# EAGLE design RPIcoffeeOptocouplerboard (EAGLE 9.4.2)
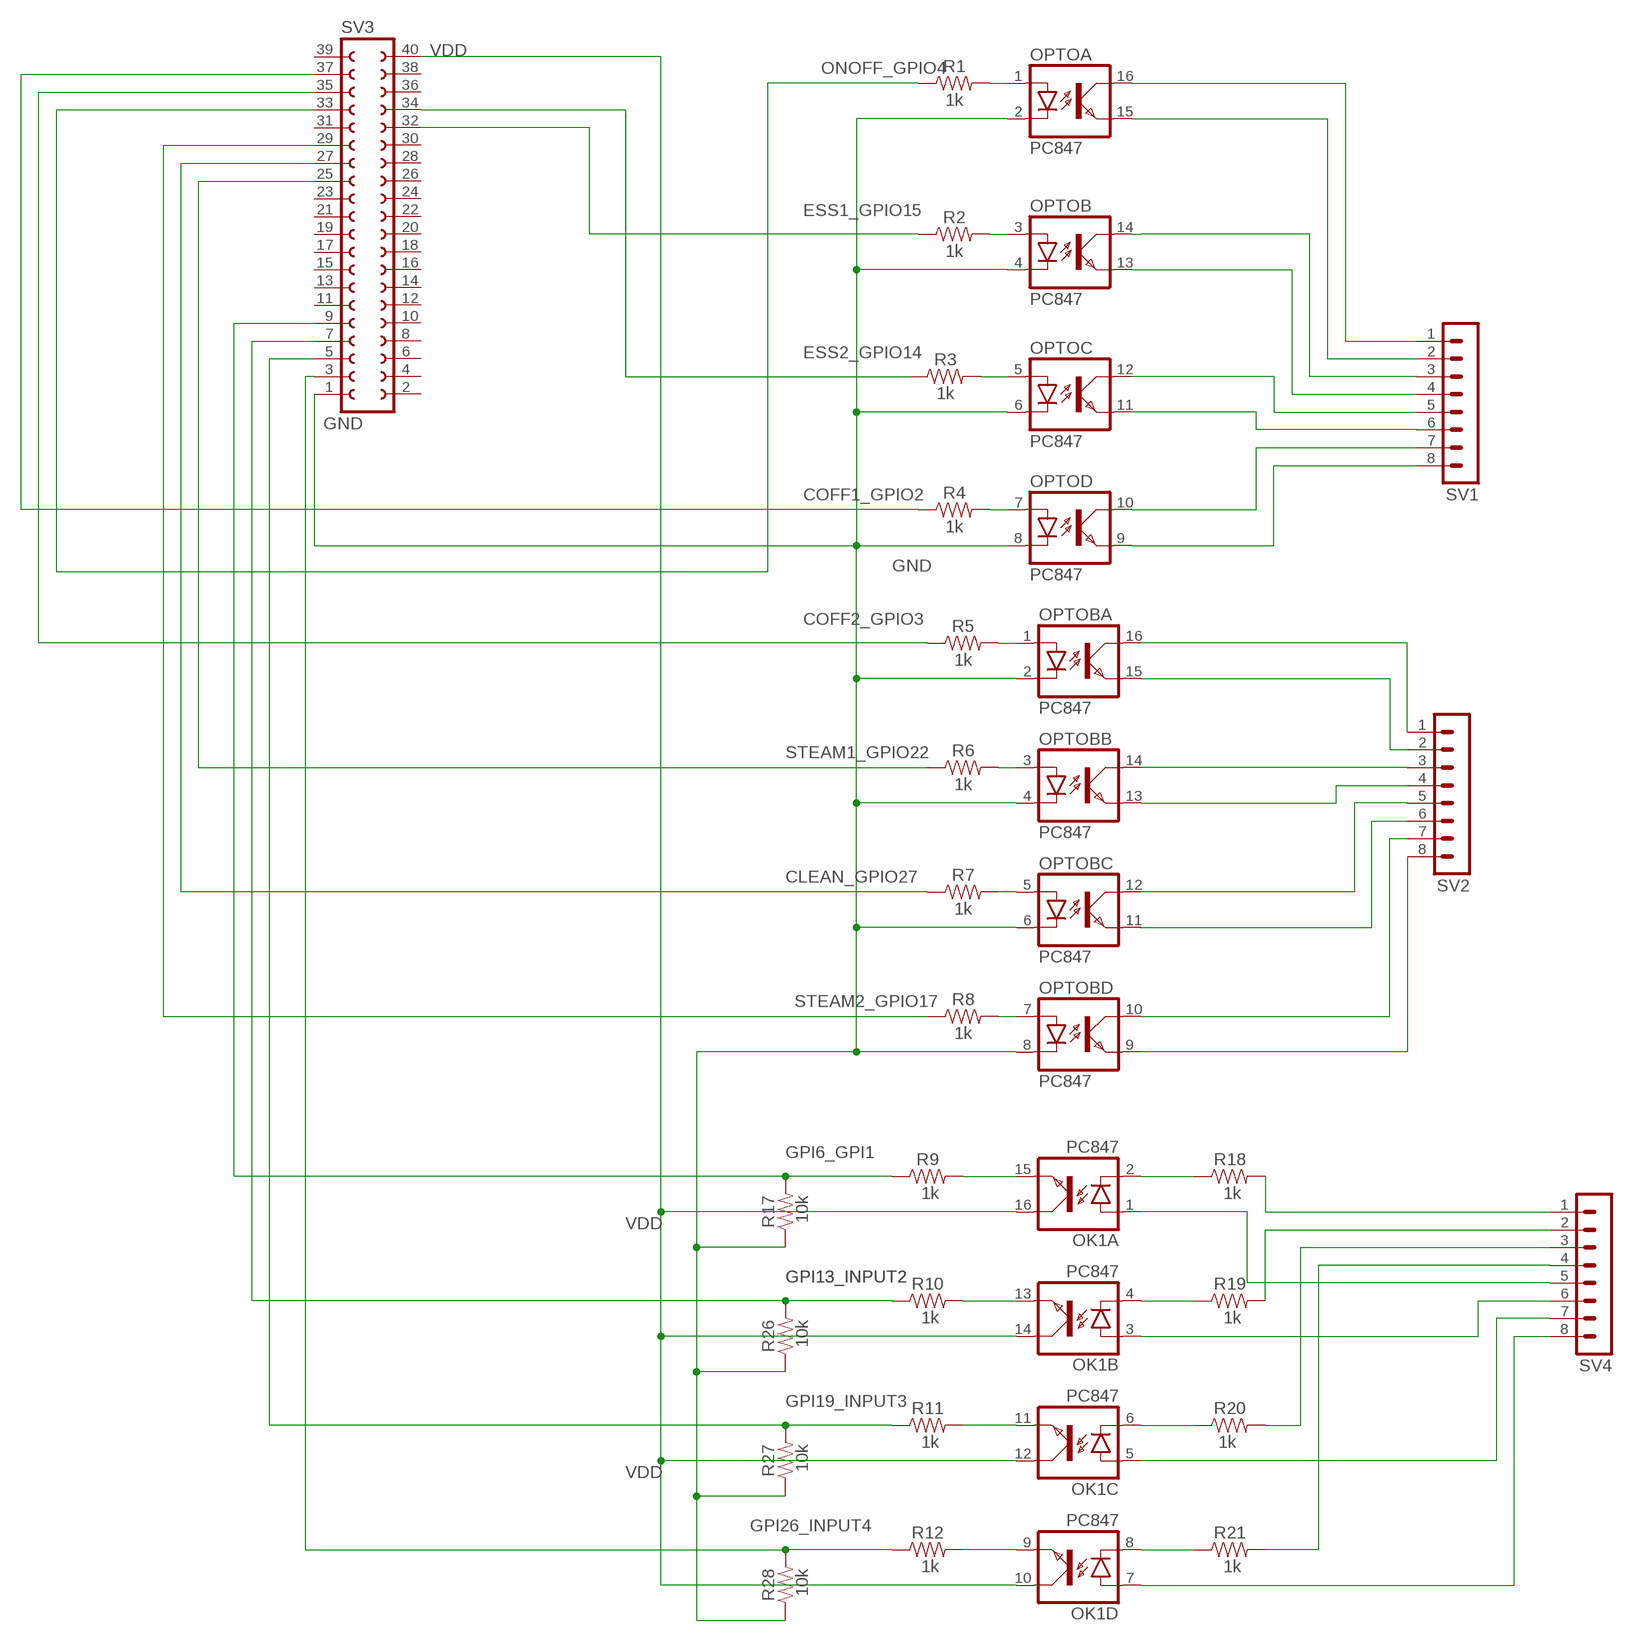
[diagram p0: schematic, sheet 1]

## Parts
OK1  PC847  [DIL16]
OPTO  PC847  [DIL16]
OPTOB  PC847  [DIL16]
R1  1k  1KOHM-HORIZ-1/4W-5%  [AXIAL-0.3]
R2  1k  1KOHM-HORIZ-1/4W-5%  [AXIAL-0.3]
R3  1k  1KOHM-HORIZ-1/4W-5%  [AXIAL-0.3]
R4  1k  1KOHM-HORIZ-1/4W-5%  [AXIAL-0.3]
R5  1k  1KOHM-HORIZ-1/4W-5%  [AXIAL-0.3]
R6  1k  1KOHM-HORIZ-1/4W-5%  [AXIAL-0.3]
R7  1k  1KOHM-HORIZ-1/4W-5%  [AXIAL-0.3]
R8  1k  1KOHM-HORIZ-1/4W-5%  [AXIAL-0.3]
R9  1k  RESISTORAXIAL-0.3  [AXIAL-0.3]
R10  1k  RESISTORAXIAL-0.3  [AXIAL-0.3]
R11  1k  RESISTORAXIAL-0.3  [AXIAL-0.3]
R12  1k  RESISTORAXIAL-0.3  [AXIAL-0.3]
R17  10k  RESISTORAXIAL-0.3  [AXIAL-0.3]
R18  1k  RESISTORAXIAL-0.3  [AXIAL-0.3]
R19  1k  RESISTORAXIAL-0.3  [AXIAL-0.3]
R20  1k  RESISTORAXIAL-0.3  [AXIAL-0.3]
R21  1k  RESISTORAXIAL-0.3  [AXIAL-0.3]
R26  10k  RESISTORAXIAL-0.3  [AXIAL-0.3]
R27  10k  RESISTORAXIAL-0.3  [AXIAL-0.3]
R28  10k  RESISTORAXIAL-0.3  [AXIAL-0.3]
SV1  MA08-1  [MA08-1]
SV2  MA08-1  [MA08-1]
SV3  FE20-2  [FE20-2]
SV4  MA08-1  [MA08-1]

## Nets
CLEAN_GPIO27: R7.P$1 SV3.27
COFF1_GPIO2: R4.P$1 SV3.37
COFF2_GPIO3: R5.P$1 SV3.35
ESS1_GPIO15: R2.P$1 SV3.32
ESS2_GPIO14: R3.P$1 SV3.34
GND: OPTO.2(A:C) OPTO.4(B:C) OPTO.6(C:C) OPTO.8(D:C) OPTOB.2(A:C) OPTOB.4(B:C) OPTOB.6(C:C) OPTOB.8(D:C) R17.P$1 R26.P$1 R27.P$1 R28.P$1 SV3.1
GPI6_GPI1: R9.P$1 R17.P$2 SV3.9
GPI13_INPUT2: R10.P$1 R26.P$2 SV3.7
GPI19_INPUT3: R11.P$1 R27.P$2 SV3.5
GPI26_INPUT4: R12.P$1 R28.P$2 SV3.3
N$1: OPTO.16(A:COL) SV1.1
N$2: OPTO.15(A:EMIT) SV1.2
N$3: OPTO.14(B:COL) SV1.3
N$4: OPTO.13(B:EMIT) SV1.4
N$5: OPTO.12(C:COL) SV1.5
N$6: OPTO.11(C:EMIT) SV1.6
N$7: OPTO.10(D:COL) SV1.7
N$8: OPTO.9(D:EMIT) SV1.8
N$9: OPTOB.16(A:COL) SV2.1
N$10: OPTOB.15(A:EMIT) SV2.2
N$11: OPTOB.14(B:COL) SV2.3
N$12: OPTOB.13(B:EMIT) SV2.4
N$13: OPTOB.12(C:COL) SV2.5
N$14: OPTOB.11(C:EMIT) SV2.6
N$15: OPTOB.10(D:COL) SV2.7
N$16: OPTOB.9(D:EMIT) SV2.8
N$17: OK1.2(A:C) R18.P$1
N$19: OPTOB.7(D:A) R8.P$2
N$20: OPTOB.5(C:A) R7.P$2
N$21: OPTOB.3(B:A) R6.P$2
N$22: OPTOB.1(A:A) R5.P$2
N$23: OPTO.7(D:A) R4.P$2
N$24: OPTO.5(C:A) R3.P$2
N$25: OPTO.1(A:A) R1.P$2
N$26: OPTO.3(B:A) R2.P$2
N$27: R18.P$2 SV4.1
N$28: R19.P$2 SV4.2
N$29: OK1.4(B:C) R19.P$1
N$30: R21.P$2 SV4.4
N$31: OK1.3(B:A) SV4.6
N$32: OK1.6(C:C) R20.P$1
N$33: OK1.7(D:A) SV4.8
N$34: OK1.5(C:A) SV4.7
N$35: OK1.8(D:C) R21.P$1
N$37: R20.P$2 SV4.3
N$39: OK1.1(A:A) SV4.5
N$51: OK1.15(A:EMIT) R9.P$2
N$54: OK1.13(B:EMIT) R10.P$2
N$55: OK1.11(C:EMIT) R11.P$2
N$57: OK1.9(D:EMIT) R12.P$2
ONOFF_GPIO4: R1.P$1 SV3.33
STEAM1_GPIO22: R6.P$1 SV3.25
STEAM2_GPIO17: R8.P$1 SV3.29
VDD: OK1.10(D:COL) OK1.12(C:COL) OK1.14(B:COL) OK1.16(A:COL) SV3.40
Unconnected: SV3.2 SV3.4 SV3.6 SV3.8 SV3.10 SV3.11 SV3.12 SV3.13 SV3.14 SV3.15 SV3.16 SV3.17 SV3.18 SV3.19 SV3.20 SV3.21 SV3.22 SV3.23 SV3.24 SV3.26 SV3.28 SV3.30 SV3.31 SV3.36 SV3.38 SV3.39

## Library data of the parts
OK1 OPTO OPTOB = optocoupler:PC847: SHARP OPTO COUPLER; OC_FARNELL: 9707735; OC_NEWARK: unknown
R1-R8 = SparkFun-Resistors:1KOHM: 1kΩ resistor A resistor is a passive two-terminal electrical component that implements electrical resistance as a circuit element. Resistors act to reduce current flow, and, at the same time, act to lower voltage levels within circuits. - Wikipedia; PROD_ID: RES-08380
R9-R12 R17-R21 R26-R28 = SparkFun-Resistors:RESISTOR: Generic Resistor Package
SV1 SV2 SV4 = con-lstb:MA08-1: PIN HEADER; OC_FARNELL: unknown; OC_NEWARK: unknown
SV3 = con-lsta:FE20-2: FEMALE HEADER; OC_FARNELL: unknown; OC_NEWARK: unknown

## Net classes
0 default: width 0.025 mm

## Board
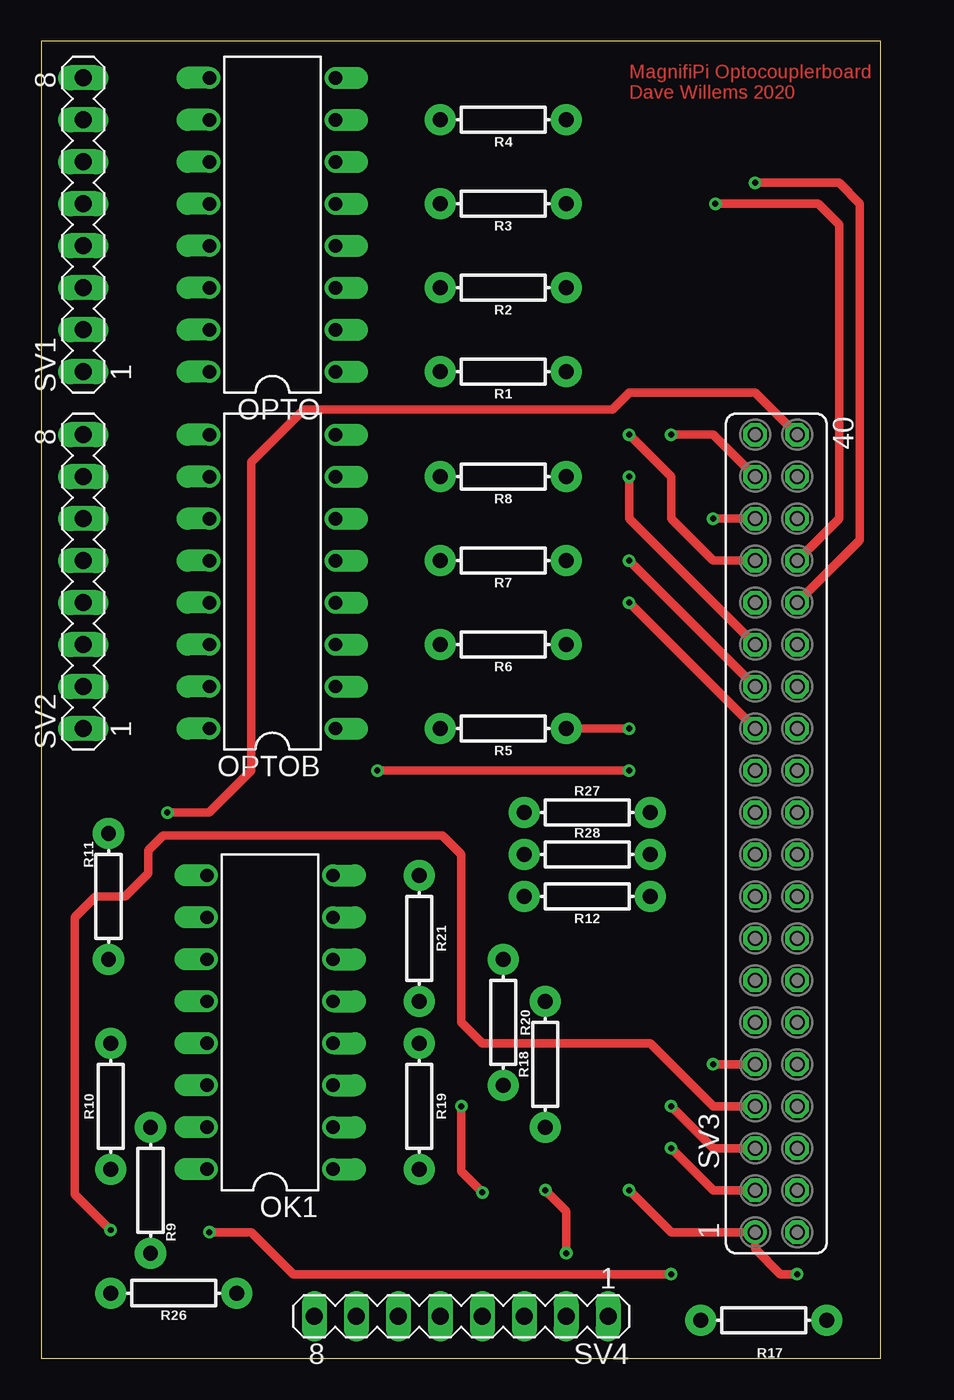
[diagram p1: board, top side]
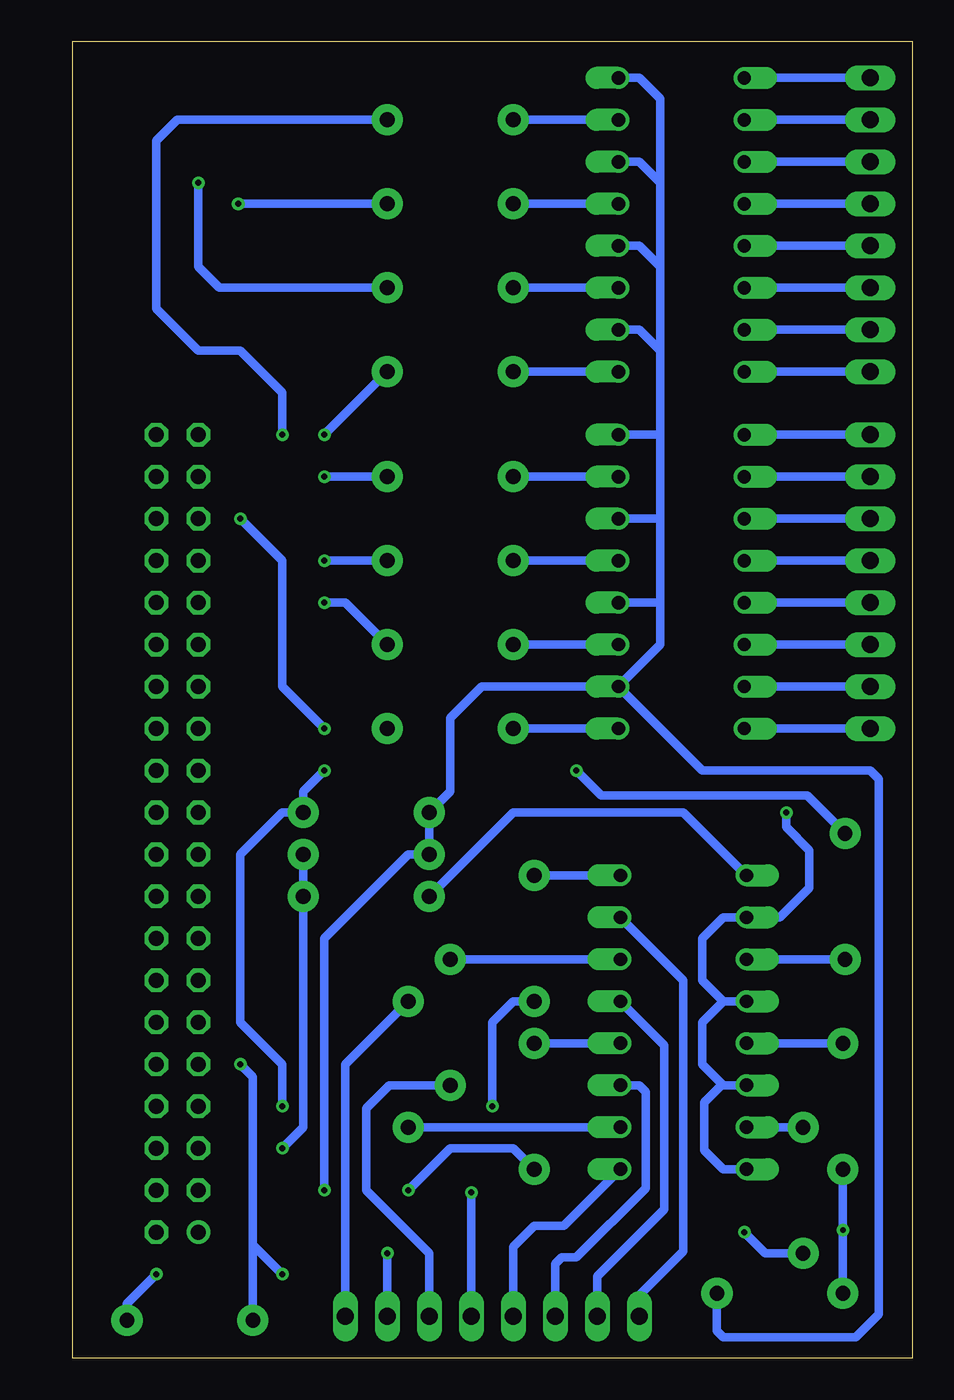
[diagram p2: board, bottom side, seen from below]

Size 50.78 x 79.68 mm. Coordinates in mm from the lower left corner, seen from the top.
Outline: 0,0 50.78,0 50.78,79.68 0,79.68 0,0
Copper layers (1*16): Top 0.035mm / dielectric 1.5mm / Bottom 0.035mm
Design rules "default *": minimum track width 20mil, minimum drill 0.35mm, track to track 6mil, track to pad 6mil, pad to pad 6mil, via to via 6mil, smd to smd 6mil, copper to edge 40mil, drill to drill 6mil, minimum pad ring 10mil, minimum via ring 8mil, stop-mask expansion 4mil, vias tented up to drill 0mil, thermal gap 10mil

### Footprints (pad centres in the part's own frame; a part is rotated, then mirrored left to right if it is on the bottom)
DIL16 = drill 0.813 offset: 1 -8.89,-3.81; 2 -6.35,-3.81; 3 -3.81,-3.81; 4 -1.27,-3.81; 5 1.27,-3.81; 6 3.81,-3.81; 7 6.35,-3.81; 8 8.89,-3.81; 9 8.89,3.81; 10 6.35,3.81; 11 3.81,3.81; 12 1.27,3.81; 13 -1.27,3.81; 14 -3.81,3.81; 15 -6.35,3.81; 16 -8.89,3.81
AXIAL-0.3 = drill 0.9 pad 1.88: P$1 -3.81,0; P$2 3.81,0
MA08-1 = drill 1.016 long: 1 -8.89,0; 2 -6.35,0; 3 -3.81,0; 4 -1.27,0; 5 1.27,0; 6 3.81,0; 7 6.35,0; 8 8.89,0
FE20-2 = drill 0.914: 1 -24.13,1.27 | drill 0.914 octagon: 2 -24.13,-1.27; 3 -21.59,1.27; 4 -21.59,-1.27; 5 -19.05,1.27; 6 -19.05,-1.27; 7 -16.51,1.27; 8 -16.51,-1.27; 9 -13.97,1.27; 10 -13.97,-1.27; 11 -11.43,1.27; 12 -11.43,-1.27; 13 -8.89,1.27; 14 -8.89,-1.27; 15 -6.35,1.27; 16 -6.35,-1.27; 17 -3.81,1.27; 18 -3.81,-1.27; 19 -1.27,1.27; 20 -1.27,-1.27; 21 1.27,1.27; 22 1.27,-1.27; 23 3.81,1.27; 24 3.81,-1.27; 25 6.35,1.27; 26 6.35,-1.27; 27 8.89,1.27; 28 8.89,-1.27; 29 11.43,1.27; 30 11.43,-1.27; 31 13.97,1.27; 32 13.97,-1.27; 33 16.51,1.27; 34 16.51,-1.27; 35 19.05,1.27; 36 19.05,-1.27; 37 21.59,1.27; 38 21.59,-1.27; 39 24.13,1.27; 40 24.13,-1.27

### Placement (x,y rotation side)
OK1  13.84,20.32 90 top
OPTO  13.97,68.58 90 top
OPTOB  13.97,46.99 90 top
R1  27.94,59.69 180 top
R2  27.94,64.77 180 top
R3  27.94,69.85 180 top
R4  27.94,74.93 180 top
R5  27.94,38.1 180 top
R6  27.94,43.18 180 top
R7  27.94,48.26 180 top
R8  27.94,53.34 180 top
R9  6.6,10.16 90 top
R10  4.19,15.24 90 top
R11  4.06,27.94 270 top
R12  33.02,27.94 180 top
R17  43.69,2.29 180 top
R18  30.48,17.78 90 top
R19  22.86,15.24 270 top
R20  27.94,20.32 270 top
R21  22.86,25.4 270 top
R26  8,3.94 180 top
R27  33.02,33.02 0 top
R28  33.02,30.48 0 top
SV1  2.54,68.58 90 top
SV2  2.54,46.99 90 top
SV3  44.45,31.75 90 top
SV4  25.4,2.54 180 top

### Tracks (layer width: path | path; a pad name or v marks a point on that pad's centre or on a via)
CLEAN_GPIO27  (via drill 0.35)
  Top 0.508: SV3.27 v35.56,48.26
  Bottom 0.508: R7.P$1 v35.56,48.26
COFF1_GPIO2  (via drill 0.35)
  Top 0.508: v38.1,55.88 40.64,55.88 SV3.37
  Bottom 0.508: R4.P$1 44.45,74.93 45.72,73.66 45.72,63.5 43.18,60.96 40.64,60.96 38.1,58.42 v38.1,55.88
COFF2_GPIO3  (via drill 0.35)
  Top 0.508: SV3.35 v40.64,50.8 | R5.P$1 v35.56,38.1
  Bottom 0.508: v40.64,50.8 38.1,48.26 38.1,40.64 v35.56,38.1
ESS1_GPIO15  (via drill 0.35)
  Top 0.508: SV3.32 49.51,49.51 49.51,69.87 48.26,71.12 v43.18,71.12
  Bottom 0.508: R2.P$1 41.91,64.77 43.18,66.04 v43.18,71.12
ESS2_GPIO14  (via drill 0.35)
  Top 0.508: v40.77,69.85 46.99,69.85 48.26,68.58 48.26,50.8 SV3.34
  Bottom 0.508: v40.77,69.85 R3.P$1
GND  (via drill 0.35)
  Top 0.508: v35.56,10.16 38.1,7.62 SV3.1 43.18,6.6 44.7,5.08 v45.72,5.08
  Bottom 0.508: OPTO.8 16.51,77.47 15.24,76.2 15.24,71.12 | 15.24,71.12 15.24,66.04 | 15.24,66.04 15.24,60.96 | 15.24,60.96 15.24,55.88 | 15.24,55.88 15.24,50.8 | 15.24,50.8 15.24,45.72 | 15.24,45.72 15.24,43.18 OPTOB.2 | OPTOB.4 15.24,45.72 | OPTOB.6 15.24,50.8 | OPTOB.8 15.24,55.88 | OPTO.2 16.51,62.23 15.24,60.96 | OPTO.4 16.51,67.31 15.24,66.04 | OPTO.6 16.51,72.39 15.24,71.12 | OPTOB.2 26.04,40.64 27.94,38.73 27.94,34.29 R27.P$1 R28.P$1 30.48,30.48 35.56,25.4 v35.56,10.16 | OPTOB.2 12.7,35.56 2.54,35.56 2.03,35.05 2.03,2.67 3.43,1.27 11.43,1.27 11.81,1.65 R26.P$1 | R17.P$1 47.5,3.3 v45.72,5.08
GPI6_GPI1  (via drill 0.35)
  Top 0.508: v10.16,7.62 12.7,7.62 15.24,5.08 v38.1,5.08 | SV3.9 v40.64,17.78
  Bottom 0.508: R9.P$1 8.89,6.35 v10.16,7.62 | v40.64,17.78 39.88,17.02 39.88,7.62 39.88,6.86 | 39.88,6.86 R17.P$2 | v38.1,5.08 39.88,6.86
GPI13_INPUT2  (via drill 0.35)
  Top 0.508: SV3.7 40.64,15.24 36.83,19.05 26.67,19.05 25.4,20.32 25.4,30.48 24.26,31.62 7.37,31.62 6.48,30.73 6.48,29.46 6.48,29.34 5.08,27.94 3.3,27.94 2.03,26.67 2.03,9.91 v4.19,7.75
  Bottom 0.508: R10.P$1 v4.19,7.75 R26.P$2
GPI19_INPUT3  (via drill 0.35)
  Top 0.508: SV3.5 40.64,12.7 v38.1,15.24 | v20.32,35.56 v35.56,35.56
  Bottom 0.508: R11.P$1 6.35,34.04 18.8,34.04 v20.32,35.56 | v35.56,35.56 36.83,34.29 R27.P$2 38.1,33.02 40.64,30.48 40.64,20.32 38.1,17.78 v38.1,15.24
GPI26_INPUT4  (via drill 0.35)
  Top 0.508: SV3.3 40.64,10.16 v38.1,12.7
  Bottom 0.508: v38.1,12.7 36.83,13.97 R12.P$1 R28.P$2
N$1
  Bottom 0.508: SV1.1 OPTO.16
N$2
  Bottom 0.508: SV1.2 OPTO.15
N$3
  Bottom 0.508: SV1.3 OPTO.14
N$4
  Bottom 0.508: OPTO.13 SV1.4
N$5
  Bottom 0.508: SV1.5 OPTO.12
N$6
  Bottom 0.508: OPTO.11 SV1.6
N$7
  Bottom 0.508: SV1.7 OPTO.10
N$8
  Bottom 0.508: SV1.8 OPTO.9
N$9
  Bottom 0.508: SV2.1 OPTOB.16
N$10
  Bottom 0.508: SV2.2 OPTOB.15
N$11
  Bottom 0.508: OPTOB.14 SV2.3
N$12
  Bottom 0.508: SV2.4 OPTOB.13
N$13
  Bottom 0.508: SV2.5 OPTOB.12
N$14
  Bottom 0.508: SV2.6 OPTOB.11
N$15
  Bottom 0.508: OPTOB.10 SV2.7
N$16
  Bottom 0.508: SV2.8 OPTOB.9
N$17
  Bottom 0.508: OK1.2 R18.P$1
N$19
  Bottom 0.508: R8.P$2 OPTOB.7
N$20
  Bottom 0.508: R7.P$2 OPTOB.5
N$21
  Bottom 0.508: R6.P$2 OPTOB.3
N$22
  Bottom 0.508: R5.P$2 OPTOB.1
N$23
  Bottom 0.508: R4.P$2 OPTO.7
N$24
  Bottom 0.508: R3.P$2 OPTO.5
N$25
  Bottom 0.508: R1.P$2 OPTO.1
N$26
  Bottom 0.508: R2.P$2 OPTO.3
N$27
  Bottom 0.508: R18.P$2 34.29,17.78 SV4.1
N$28  (via drill 0.35)
  Top 0.508: v30.48,10.16 31.75,8.89 v31.75,6.35
  Bottom 0.508: R19.P$2 24.13,12.7 27.94,12.7 v30.48,10.16 | v31.75,6.35 SV4.2
N$29
  Bottom 0.508: OK1.4 R19.P$1
N$30  (via drill 0.35)
  Top 0.508: v25.4,15.24 25.4,11.3 v26.67,10.03
  Bottom 0.508: R21.P$2 24.13,21.59 25.4,20.32 v25.4,15.24 | SV4.4 v26.67,10.03
N$31
  Bottom 0.508: SV4.6 21.59,5.71 21.21,6.1 20.32,6.1 16.13,10.29 16.13,16.13 16.51,16.51 OK1.3
N$32
  Bottom 0.508: R20.P$1 OK1.6
N$33
  Bottom 0.508: OK1.7 13.84,22.86 13.84,6.48 16.51,3.81 SV4.8
N$34
  Bottom 0.508: SV4.7 19.05,4.95 14.99,9.02 14.99,18.92 OK1.5
N$35
  Bottom 0.508: R21.P$1 OK1.8
N$37
  Bottom 0.508: R20.P$2 31.62,16.51 33.02,15.11 33.02,10.16 29.21,6.35 SV4.3
N$39
  Bottom 0.508: OK1.1 21.08,8 22.86,8 24.13,6.73 SV4.5
N$51
  Bottom 0.508: R9.P$2 OK1.15
N$54
  Bottom 0.508: R10.P$2 OK1.13
N$55
  Bottom 0.508: R11.P$2 OK1.11
N$57
  Bottom 0.508: OK1.9 13.84,33.02 24.13,33.02 R12.P$2
ONOFF_GPIO4  (via drill 0.35)
  Top 0.508: SV3.33 40.64,48.26 38.1,50.8 38.1,53.34 v35.56,55.88
  Bottom 0.508: R1.P$1 v35.56,55.88
STEAM1_GPIO22  (via drill 0.35)
  Top 0.508: SV3.25 v35.56,45.72
  Bottom 0.508: v35.56,45.72 34.29,45.72 R6.P$1
STEAM2_GPIO17  (via drill 0.35)
  Top 0.508: SV3.29 35.56,50.8 v35.56,53.34
  Bottom 0.508: R8.P$1 v35.56,53.34
VDD  (via drill 0.35)
  Top 0.508: SV3.40 43.18,58.42 35.56,58.42 34.54,57.4 15.88,57.4 12.7,54.23 12.7,35.56 10.16,33.02 v7.62,33.02
  Bottom 0.508: v7.62,33.02 7.62,32.13 6.22,30.73 6.22,28.45 8,26.67 OK1.10 11.43,26.67 12.7,25.4 12.7,22.86 11.43,21.59 | OK1.16 11.43,11.43 12.57,12.57 12.57,15.49 11.56,16.51 OK1.14 11.43,16.51 12.7,17.78 12.7,20.32 11.43,21.59 | OK1.12 10.16,21.59 11.43,21.59

### Text on the board
Top: MagnifiPi Optocouplerboard / Dave Willems 2020